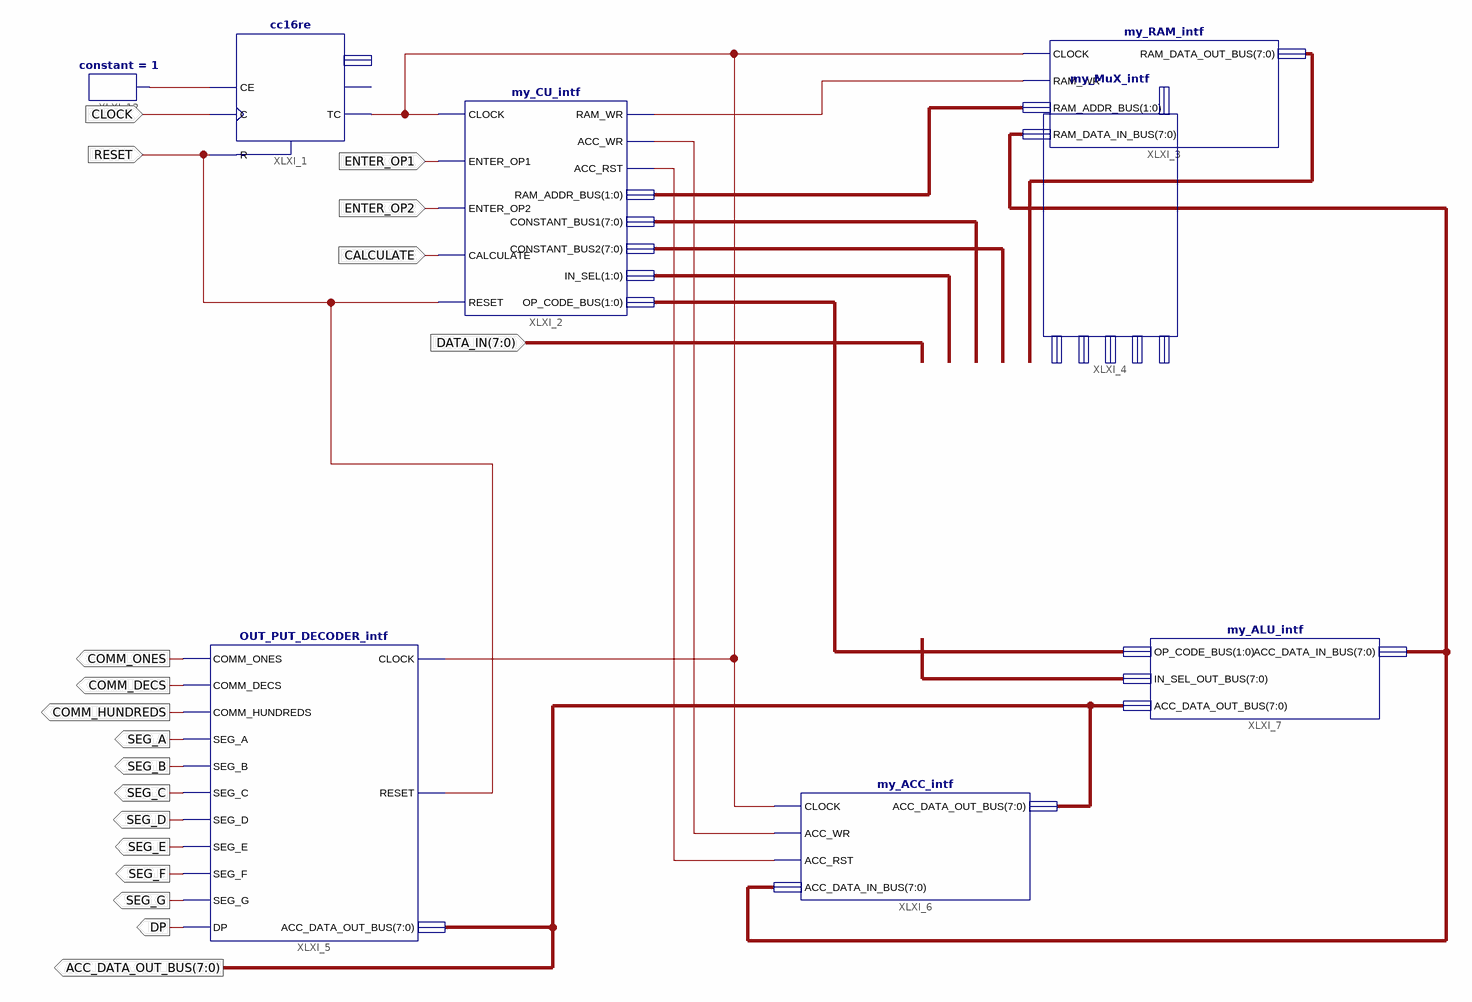
[diagram p0: schematic sheet 1]
// Xilinx ISE schematic TopLevel.sch (spartan3a) as structural Verilog: 8 symbols, 18 ports
module TopLevel (
  input  RESET,
  input  CLOCK,
  input  ENTER_OP1,
  input  ENTER_OP2,
  input  CALCULATE,
  input  [7:0] DATA_IN,
  output [7:0] ACC_DATA_OUT_BUS,
  output COMM_ONES,
  output COMM_DECS,
  output COMM_HUNDREDS,
  output SEG_A,
  output SEG_B,
  output SEG_C,
  output SEG_D,
  output SEG_E,
  output SEG_F,
  output SEG_G,
  output DP
);

  wire XLXN_8, XLXN_9, XLXN_55, XLXN_58, XLXN_81;
  wire [1:0] XLXN_10, XLXN_14, XLXN_50;
  wire [7:0] XLXN_11, XLXN_12, XLXN_13, XLXN_30, XLXN_83;

  my_MuX_intf XLXI_4 (
    .DATA_IN(DATA_IN), .IN_SEL(XLXN_14), .CONSTANT_BUS1(XLXN_12), .CONSTANT_BUS2(XLXN_13),
    .RAM_DATA_OUT_BUS(XLXN_11), .IN_SEL_OUT_BUS(XLXN_83));
  OUT_PUT_DECODER_intf XLXI_5 (
    .CLOCK(XLXN_8), .RESET(RESET), .ACC_DATA_OUT_BUS(ACC_DATA_OUT_BUS), .COMM_ONES(COMM_ONES),
    .COMM_DECS(COMM_DECS), .COMM_HUNDREDS(COMM_HUNDREDS), .SEG_A(SEG_A), .SEG_B(SEG_B), .SEG_C(SEG_C),
    .SEG_D(SEG_D), .SEG_E(SEG_E), .SEG_F(SEG_F), .SEG_G(SEG_G), .DP(DP));
  my_ACC_intf XLXI_6 (
    .CLOCK(XLXN_8), .ACC_WR(XLXN_58), .ACC_RST(XLXN_55), .ACC_DATA_IN_BUS(XLXN_30),
    .ACC_DATA_OUT_BUS(ACC_DATA_OUT_BUS));
  my_ALU_intf XLXI_7 (
    .OP_CODE_BUS(XLXN_50), .IN_SEL_OUT_BUS(XLXN_83), .ACC_DATA_OUT_BUS(ACC_DATA_OUT_BUS),
    .ACC_DATA_IN_BUS(XLXN_30));
  my_RAM_intf XLXI_3 (
    .CLOCK(XLXN_8), .RAM_WR(XLXN_9), .RAM_ADDR_BUS(XLXN_10), .RAM_DATA_IN_BUS(XLXN_30),
    .RAM_DATA_OUT_BUS(XLXN_11));
  my_CU_intf XLXI_2 (
    .CLOCK(XLXN_8), .ENTER_OP1(ENTER_OP1), .ENTER_OP2(ENTER_OP2), .CALCULATE(CALCULATE), .RESET(RESET),
    .RAM_WR(XLXN_9), .ACC_WR(XLXN_58), .ACC_RST(XLXN_55), .RAM_ADDR_BUS(XLXN_10), .CONSTANT_BUS1(XLXN_12),
    .CONSTANT_BUS2(XLXN_13), .IN_SEL(XLXN_14), .OP_CODE_BUS(XLXN_50));
  cc16re XLXI_1 (.C(CLOCK), .CE(XLXN_81), .R(RESET), .TC(XLXN_8));  // open: CEO, Q
  constant #(.CValue("1")) XLXI_12 (.O(XLXN_81));
endmodule
